# Altium schematic sheet PID Controller.SchDoc
size A; SheetNumber: 1; SheetTotal: 1
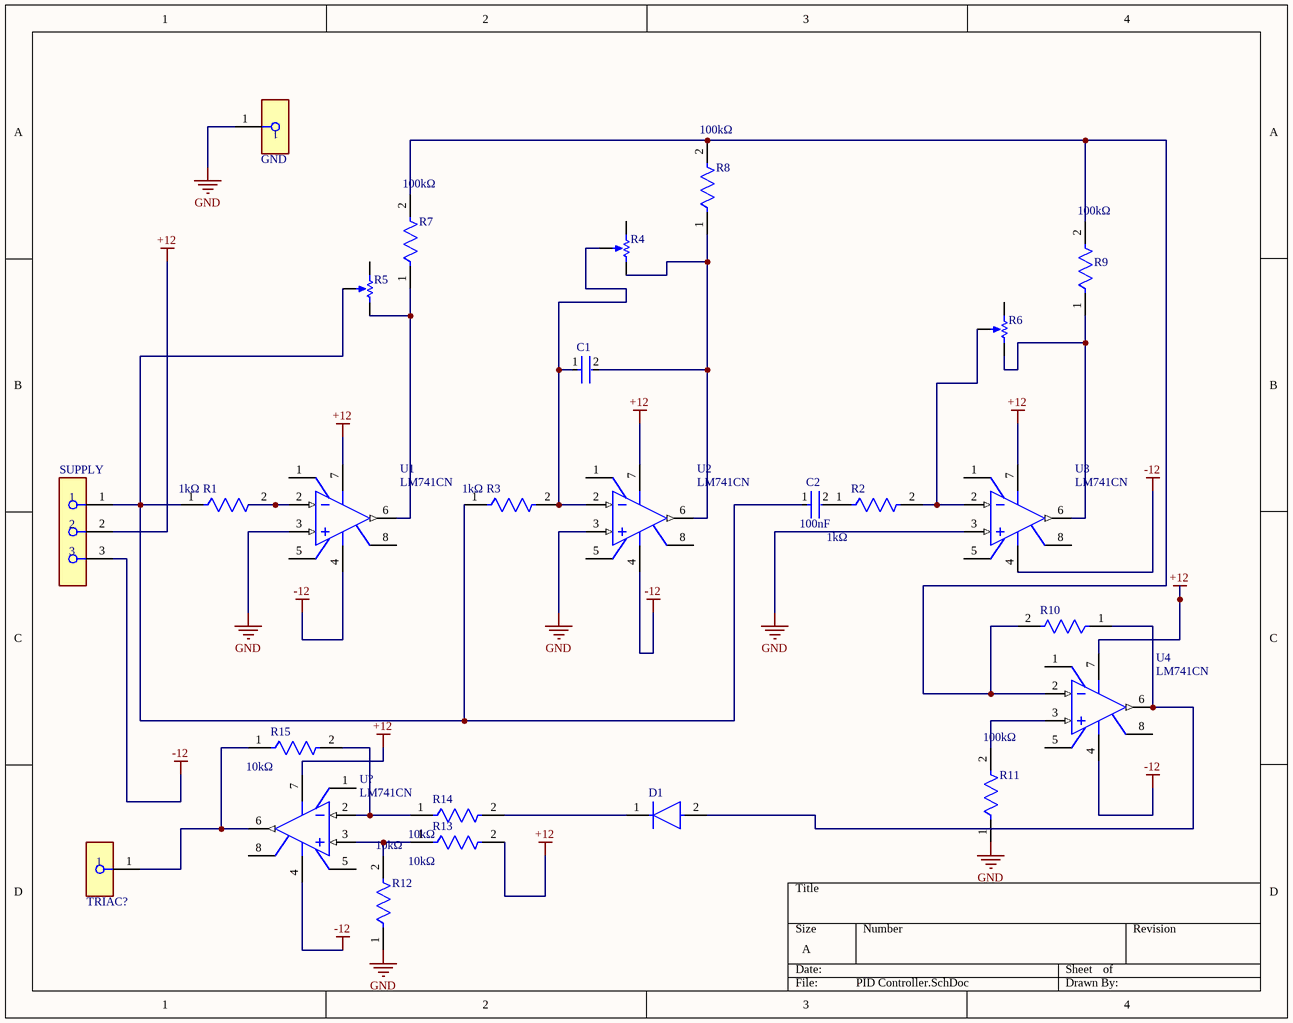
[diagram p0: PID Controller.SchDoc]

## Parts
C1  SR205C104KAR  [FP-SR20-MFG]  (value not drawn)
C2  value 100nF  [FP-SR20-MFG]  (hidden comment: SR205C104KAR)
D1  1N4007-E3/54  [FP-1N4007-MFG]  (value not drawn)
GND  1801-0-15-15-30-27-04-0  [FP-1801-0-15-15-30-27-04-MFG]  (value not drawn)
R1  Resistance: 1kΩ  [FP-CF18-MFG]  (hidden comment: CF18JT2K20)
R2  Resistance: 1kΩ  [FP-CF18-MFG]  (hidden comment: CF18JT2K20)
R3  Resistance: 1kΩ  [FP-CF18-MFG]  (hidden comment: CF18JT2K20)
R4  3362P-1-104LF  [BOUR-3362P]  (value not drawn)
R5  3362P-1-104LF  [BOUR-3362P]  (value not drawn)
R6  3362P-1-104LF  [BOUR-3362P]  (value not drawn)
R7  Resistance: 100kΩ  [FP-CF18-MFG]  (hidden comment: CF18JT2K20)
R8  Resistance: 100kΩ  [FP-CF18-MFG]  (hidden comment: CF18JT2K20)
R9  Resistance: 100kΩ  [FP-CF18-MFG]  (hidden comment: CF18JT2K20)
R10  CF18JT2K20  [FP-CF18-MFG]  (value not drawn)
R11  Resistance: 100kΩ  [FP-CF18-MFG]  (hidden comment: CF18JT2K20)
R12  value 10kΩ  [FP-CF18-MFG]  (hidden comment: CF18JT2K20)
R13  value 10kΩ  [FP-CF18-MFG]  (hidden comment: CF18JT2K20)
R14  value 10kΩ  [FP-CF18-MFG]  (hidden comment: CF18JT2K20)
R15  value 10kΩ  [FP-CF18-MFG]  (hidden comment: CF18JT2K20)
SUPPLY  SSQ-103-01-T-S  [FP-SSQ-103-01-T-S-MFG]  (value not drawn)
TRIAC?  1801-0-15-15-30-27-04-0  [FP-1801-0-15-15-30-27-04-MFG]  (value not drawn)
U1  LM741CN  [N08E]
U2  LM741CN  [N08E]
U3  LM741CN  [N08E]
U4  LM741CN  [N08E]
U?  LM741CN  [N08E]

## Nets
+12: R13.2 SUPPLY.2 U1.7(V+) U2.7(V+) U3.7(V+) U4.7(V+) U?.7(V+)
-12: SUPPLY.3 U1.4(V-) U2.4(V-) U3.4(V-) U4.4(V-) U?.4(V-)
GND: GND.1 R11.1 R12.1 U1.3(IN+) U2.3(IN+) U3.3(IN+)
NetC1_1: C1.1 R3.2 R4.2(S) U2.2(IN-)
NetC1_2: C1.2 R4.3(CW) R8.1 U2.6(OUT)
NetC2_1: C2.1 R1.1 R3.1 R5.2(S) SUPPLY.1
NetC2_2: C2.2 R2.1
NetD1_1: D1.1(C) R14.2
NetD1_2: D1.2(A) R10.1 U4.6(OUT)
NetR1_2: R1.2 U1.2(IN-)
NetR2_2: R2.2 R6.2(S) U3.2(IN-)
NetR5_3: R5.3(CW) R7.1 U1.6(OUT)
NetR6_3: R6.3(CW) R9.1 U3.6(OUT)
NetR7_2: R7.2 R8.2 R9.2 R10.2 U4.2(IN-)
NetR11_2: R11.2 U4.3(IN+)
NetR12_2: R12.2 R13.1 U?.3(IN+)
NetR14_1: R14.1 R15.2 U?.2(IN-)
NetR15_1: R15.1 TRIAC?.1 U?.6(OUT)

Not connected (* = marked no-connect by the designer): R4 1(CCW); R5 1(CCW); R6 1(CCW); U1 1(OFS_NULL) 5(OFS_NULL) 8(NC); U2 1(OFS_NULL) 5(OFS_NULL) 8(NC); U3 1(OFS_NULL) 5(OFS_NULL) 8(NC); U4 1(OFS_NULL) 5(OFS_NULL) 8(NC); U? 1(OFS_NULL) 5(OFS_NULL) 8(NC)

## Library data of the parts
C1 = CMP-04427-000013-1: CAP CER 0.1UF 50V X7R RADIAL; Manufacturer: AVX; Material: Ceramic; Tolerance: 10%; Capacitance: 100nF; Value: 100nF; Voltage: 50V; Height: 5.08mm; Digikey Description: CAP CER 0.1UF 50V X7R RADIAL; Device Class L2: Capacitors; ComponentLink2URL: http://datasheets.avx.com/SR-Series.pdf; Temperature Range High: +125°C; Lead Free: Yes; Manufacturer Part Number: SR205C104KAR; Category: Cap; Device Class L1: Passive Components; Temperature: -55°C to +125°C; Voltage Rating: 50V; ComponentLink2Description: Datasheet; RoHS: TRUE; Automotive: No; Octopart: https://octopart.com/sr205c104kar-avx-145048; Mouser Description: Multilayer Ceramic Capacitors MLCC - Leaded 50volts 0.1uF 10% X7R; Temperature Characteristic: X7R; Device Class L3: Ceramic Capacitors; Temperature Range Low: -55°C; Package: SR20
C2 = CMP-04427-000013-1: CAP CER 0.1UF 50V X7R RADIAL; Manufacturer: AVX; Material: Ceramic; Tolerance: 10%; Voltage: 50V; Height: 5.08mm; Digikey Description: CAP CER 0.1UF 50V X7R RADIAL; Device Class L2: Capacitors; Capacitance: 100nF; ComponentLink2URL: http://datasheets.avx.com/SR-Series.pdf; Temperature Range High: +125°C; Lead Free: Yes; Manufacturer Part Number: SR205C104KAR; Category: Cap; Device Class L1: Passive Components; Temperature: -55°C to +125°C; Voltage Rating: 50V; ComponentLink2Description: Datasheet; RoHS: TRUE; Automotive: No; Octopart: https://octopart.com/sr205c104kar-avx-145048; Mouser Description: Multilayer Ceramic Capacitors MLCC - Leaded 50volts 0.1uF 10% X7R; Temperature Characteristic: X7R; Device Class L3: Ceramic Capacitors; Temperature Range Low: -55°C; Package: SR20
D1 = CMP-02540-000046-1: DIODE GEN PURP 1KV 1A DO204AL; Manufacturer: Vishay; Value: 15pF; Max Junction Temp: +150°C; Max Surge Forward Current: 30A; Max Repetitive Reverse Voltage: 1000V; Peak Reverse Current: 30uA; Octopart: https://octopart.com/1n4007-e3%2F54-vishay-39548207; Digikey Description: DIODE GEN PURP 1KV 1A DO204AL; Category: Diode; Mouser Description: Rectifiers Vr/1000V Io/1A; Automotive: No; Package: 1N4007; Device Class L3: Rectifier Diodes; Temperature Range High: +150°C; Capacitance: 15pF; Ipc Land Pattern Name: DIOPA1088W105L520D270; Lead Free: Yes; ComponentLink2Description: Datasheet; Forward Current: 1A; Device Class L1: Discrete Semiconductors; ComponentLink2URL: http://www.vishay.com/docs/88503/1n4001.pdf; Temperature Range Low: -50°C; Height: 2.7mm; RoHS: TRUE; Temperature: -50°C to +150°C; Device Class L2: Diodes; Manufacturer Part Number: 1N4007-E3/54
GND TRIAC? = CMP-07777-000001-1: CONN PIN RCPT .015-.025 PRESSFIT; Manufacturer: Mill-Max; Conn Orientation: Straight; Number Of Contacts: 1; Is Female: yes; Current Rating: 3A; Device Class L2: unset; Automotive: No; Temperature Range High: +125°C; Lead Free: Yes; Mouser Description: Circuit Board Hardware - PCB 10u AU OVER NI 30 CON; ComponentLink2URL: https://www.mill-max.com/products/datasheet/recpin/1801-0-15-15-30-27-04-0; Octopart: https://octopart.com/1801-0-15-15-30-27-04-0-mill-max-1175098; Device Class L1: Connectors; Manufacturer Part Number: 1801-0-15-15-30-27-04-0; Temperature Range Low: -55°C; Digikey Description: CONN PIN RCPT .015-.025 PRESSFIT; Package: 1801-0-15-15-30-27-04-0; ComponentLink2Description: Datasheet; Device Class L3: unset; RoHS: TRUE; Contact Material: Gold,Nickel; Category: Conn; Temperature: -55°C to +125°C; Height: 4.32mm
R1-R3 R7 R11 = CMP-26528-000001-1: RES 2.2K OHM 1/8W 5% CF AXIAL; Manufacturer: Stackpole Electronics Inc; Value: 2.2kΩ; Voltage Rating: 250V; Temperature Coefficient: 0/-400ppm/°C; Power Rating: 0.125W; Composition: Carbon Film; Octopart: https://octopart.com/cf18jt2k20-stackpole+electronics-19205714; Tolerance: 5%; Series: CF; Temperature Range Low: -55°C; ComponentLink2URL: https://www.seielect.com/catalog/sei-cf_cfm.pdf; Ipc Land Pattern Name: RESAD656W65L360D200; Package: CF18; Device Class L2: Resistors; Device Class L3: Through-Hole Resistors; Height: 2mm; Category: Res; ComponentLink2Description: Datasheet; Manufacturer Part Number: CF18JT2K20; Lead Free: Yes; Temperature Range High: +155°C; Temperature: -55°C to +155°C; RoHS: TRUE; Device Class L1: Passive Components; Digikey Description: RES 2.2K OHM 1/8W 5% CF AXIAL; Automotive: No
R4-R6 = CMP-1747-00003-1: Square Trimpot(R) Trimming Potentiometer, 100 KOhm, 300 V, -55 to 125 degC, 3-Pin THD, RoHS, Tube; Voltage Rating: 250 V; Case\Package: Axial; Tolerance: 1%; Power Rating: 250 mW; Resistance: 1 mohm; RoHSCompliant: true; ComponentLink2URL: http://www.bourns.com/docs/Product-Datasheets/3362.pdf; ComponentLink1Description: Manufacturer URL; DatasheetVersion: May-16; Package Quantity: 200; ComponentLink2Description: Datasheet; Min Operating Temperature: -55 degC; Mount: Through Hole; PackageDescription: 3-Pin Through Hole Device, Body 6.6 x 6.99 mm, Pitch 2.54 mm; Length: 0.248 inch; ComponentLink1URL: http://www.bourns.com/; PackageReference: 3326P; Max Operating Temperature: 155 degC; Packaging: Bulk
R8 R9 = CMP-26528-000001-1: RES 2.2K OHM 1/8W 5% CF AXIAL; Manufacturer: Stackpole Electronics Inc; Value: 1kΩ; Voltage Rating: 250V; Temperature Coefficient: 0/-400ppm/°C; Power Rating: 0.125W; Composition: Carbon Film; Octopart: https://octopart.com/cf18jt2k20-stackpole+electronics-19205714; Tolerance: 5%; Series: CF; Temperature Range Low: -55°C; ComponentLink2URL: https://www.seielect.com/catalog/sei-cf_cfm.pdf; Ipc Land Pattern Name: RESAD656W65L360D200; Package: CF18; Device Class L2: Resistors; Device Class L3: Through-Hole Resistors; Height: 2mm; Category: Res; ComponentLink2Description: Datasheet; Manufacturer Part Number: CF18JT2K20; Lead Free: Yes; Temperature Range High: +155°C; Temperature: -55°C to +155°C; RoHS: TRUE; Device Class L1: Passive Components; Digikey Description: RES 2.2K OHM 1/8W 5% CF AXIAL; Automotive: No
R10 = CMP-26528-000001-1: RES 2.2K OHM 1/8W 5% CF AXIAL; Manufacturer: Stackpole Electronics Inc; Value: 2.2kΩ; Voltage Rating: 250V; Temperature Coefficient: 0/-400ppm/°C; Resistance: 100kΩ; Power Rating: 0.125W; Composition: Carbon Film; Octopart: https://octopart.com/cf18jt2k20-stackpole+electronics-19205714; Tolerance: 5%; Series: CF; Temperature Range Low: -55°C; ComponentLink2URL: https://www.seielect.com/catalog/sei-cf_cfm.pdf; Ipc Land Pattern Name: RESAD656W65L360D200; Package: CF18; Device Class L2: Resistors; Device Class L3: Through-Hole Resistors; Height: 2mm; Category: Res; ComponentLink2Description: Datasheet; Manufacturer Part Number: CF18JT2K20; Lead Free: Yes; Temperature Range High: +155°C; Temperature: -55°C to +155°C; RoHS: TRUE; Device Class L1: Passive Components; Digikey Description: RES 2.2K OHM 1/8W 5% CF AXIAL; Automotive: No
R12-R15 = CMP-26528-000001-1: RES 2.2K OHM 1/8W 5% CF AXIAL; Manufacturer: Stackpole Electronics Inc; Voltage Rating: 250V; Temperature Coefficient: 0/-400ppm/°C; Resistance: 1kΩ; Power Rating: 0.125W; Composition: Carbon Film; Octopart: https://octopart.com/cf18jt2k20-stackpole+electronics-19205714; Tolerance: 5%; Series: CF; Temperature Range Low: -55°C; ComponentLink2URL: https://www.seielect.com/catalog/sei-cf_cfm.pdf; Ipc Land Pattern Name: RESAD656W65L360D200; Package: CF18; Device Class L2: Resistors; Device Class L3: Through-Hole Resistors; Height: 2mm; Category: Res; ComponentLink2Description: Datasheet; Manufacturer Part Number: CF18JT2K20; Lead Free: Yes; Temperature Range High: +155°C; Temperature: -55°C to +155°C; RoHS: TRUE; Device Class L1: Passive Components; Digikey Description: RES 2.2K OHM 1/8W 5% CF AXIAL; Automotive: No
SUPPLY = CMP-02766-001396-1: CONN RCPT 3POS 0.1 TIN PCB; Pitch: 2.54mm; Connector Type: Receptacle; Max Current Rating: 7.6A; Max Voltage Rating (AC): 550V; Gender: Female; Number of Positions: 3; Contact Resistance: 10mR; Length: 8.13mm; Color: Black; Packaging: Bulk; Height: 8.51mm; RoHS Compliant: Yes; Min Operating Temperature: -55°C; Contact Type: Female Socket; Number of Rows: 1; Series: SSQ; Housing Color: Black; Lead Free: Lead Free; Mount: Through Hole; Housing Material: Plastic; Contact Material: Bronze; Contact Plating: Tin; Orientation: Straight; Termination: Solder; Max Operating Temperature: 105°C; Width: 2.41mm; Radiation Hardening: No; Number of Contacts: 3
U1-U4 U? = CMP-0055-00155-2: Operational Amplifier, 8-pin MDIP; Manufacturer: National Semiconductor; PowerWise: N; CompType: Amplifiers; PackageTopMarking: NSUZXYTTE#*LM*741CN; PackageVersion: revG, May-2006; Code_JEDEC: MS-001-BA; RoHS: N; ComponentLink2URL: http://www.national.com/pf/LM/LM741.html; ComponentLink3Description: N08E Package Page; PackageReference: N08E; ComponentLink1Description: LM741 Datasheet; PinCount: 8; ComponentLink1URL: http://www.national.com/ds/LM/LM741.pdf; ComponentLink2Description: LM741 Web Page; DatasheetVersion: Aug-2000; PackageDescription: MDIP, .365 x .250 x .130in, 8 Lead, .100in Pitch; RevisionNote: Component URLs added; ComponentLink3URL: http://www.national.com/packaging/folders/n08e.html